# Altium schematic sheet Main_sch.SchDoc: Main Schematic
size A4; CompanyName: Keri Studio; DrawnBy: Ashisg Talaviya; Organization: KERI STUDIO; Address1: ICG COMPOUND; Address2: NR. BHAVANI CIRCLE; Address3: A.K. ROAD; Address4: SURAT-395008; DocumentNumber: 0; Revision: 1.0; SheetNumber: 0; SheetTotal: 4
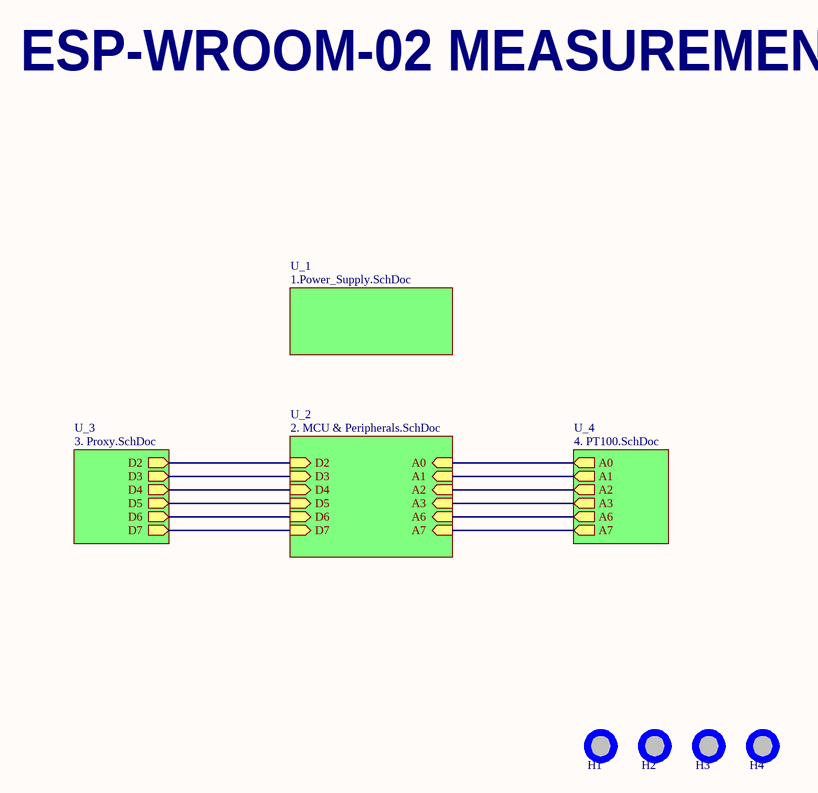
[diagram p0: Main_sch.SchDoc]

## Parts
H1  Hole  [Hole_4mm]  (value not drawn)  (no BOM)
H2  Hole  [Hole_4mm]  (value not drawn)  (no BOM)
H3  Hole  [Hole_4mm]  (value not drawn)  (no BOM)
H4  Hole  [Hole_4mm]  (value not drawn)  (no BOM)

## Sub-sheets
U_1 = 1.Power_Supply.SchDoc: no entries
U_2 = 2. MCU & Peripherals.SchDoc: A0 (in), A1 (in), A2 (in), A3 (in), A6 (in), A7 (in), D2 (in), D3 (in), D4 (in), D5 (in), D6 (in), D7 (in)
U_3 = 3. Proxy.SchDoc: D2 (out), D3 (out), D4 (out), D5 (out), D6 (out), D7 (out)
U_4 = 4. PT100.SchDoc: A0 (out), A1 (out), A2 (out), A3 (out), A6 (out), A7 (out)

## Nets
(unnamed): sheet U_2/A0, sheet U_4/A0
(unnamed): sheet U_2/A1, sheet U_4/A1
(unnamed): sheet U_2/A2, sheet U_4/A2
(unnamed): sheet U_2/A3, sheet U_4/A3
(unnamed): sheet U_2/A6, sheet U_4/A6
(unnamed): sheet U_2/A7, sheet U_4/A7
(unnamed): sheet U_2/D2, sheet U_3/D2
(unnamed): sheet U_2/D3, sheet U_3/D3
(unnamed): sheet U_2/D4, sheet U_3/D4
(unnamed): sheet U_2/D5, sheet U_3/D5
(unnamed): sheet U_2/D6, sheet U_3/D6
(unnamed): sheet U_2/D7, sheet U_3/D7

## Notes on the sheet
- ESP-WROOM-02 MEASUREMENT
- Title
- Size:
- A4
- Number:
- Revision:
- Date:
- Time:
- Sheet
- of

## Library data of the parts
H1-H4 = Hole: Corner Hole with 4mm Drill